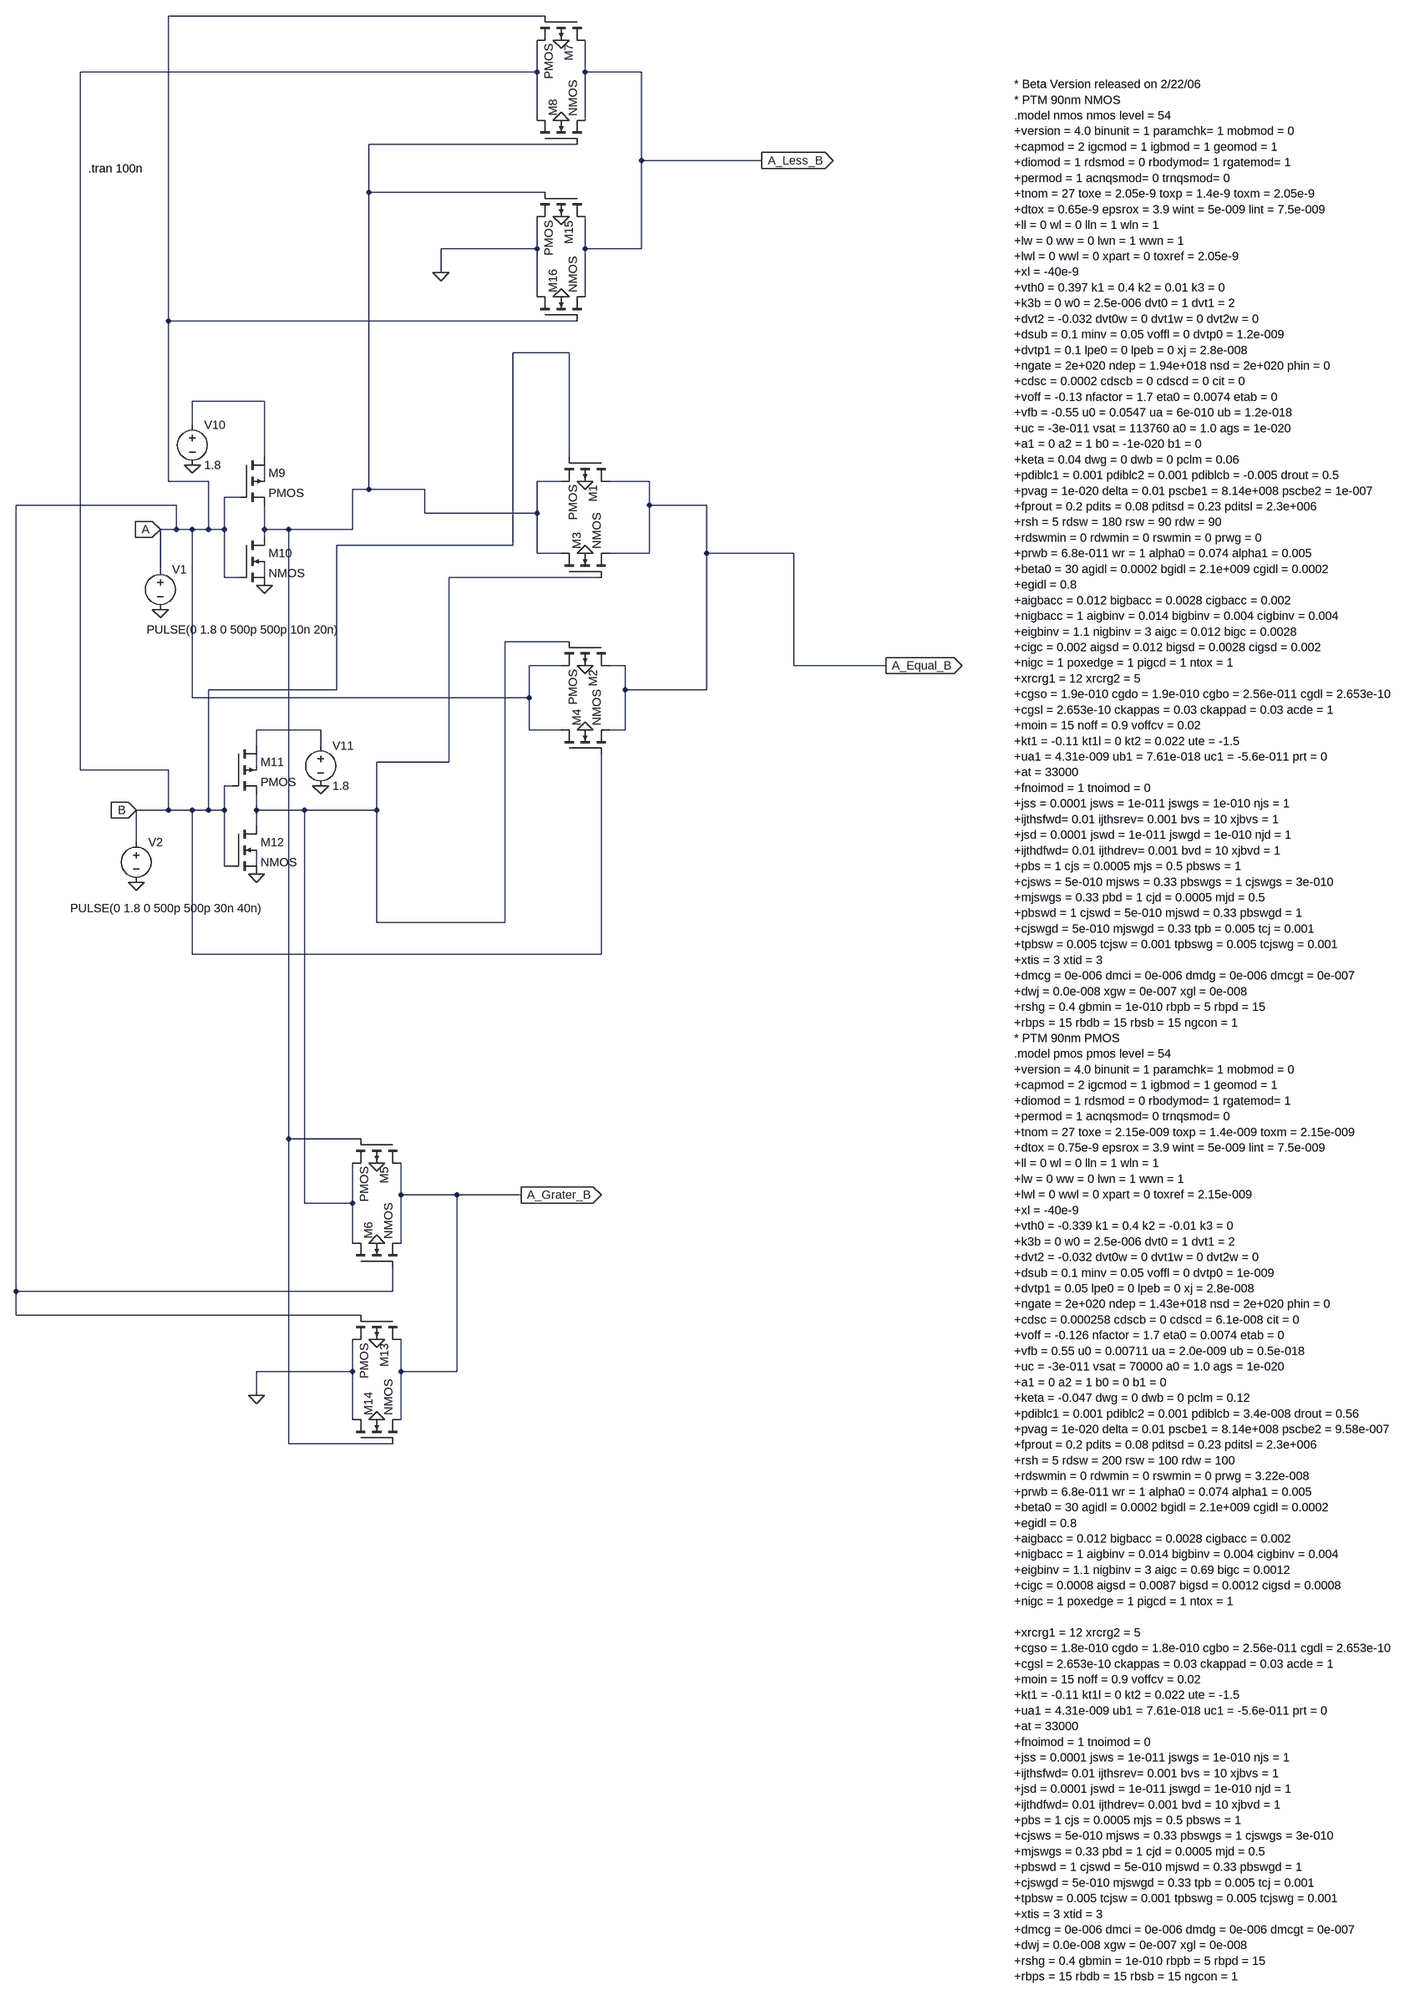
[diagram p0: schematic Comparator-tg-90nm.asc]
Comparator-tg-90nm.asc, the LTspice schematic file:
Version 4
SHEET 1 2340 1880
WIRE 160 -976 -592 -976
WIRE 144 -864 144 -928
WIRE 144 -864 -768 -864
WIRE 240 -864 240 -928
WIRE 352 -864 240 -864
WIRE 144 -768 144 -864
WIRE 240 -768 240 -864
WIRE 224 -720 -192 -720
WIRE 352 -688 352 -864
WIRE 816 -688 352 -688
WIRE -192 -624 -192 -720
WIRE 160 -624 -192 -624
WIRE 144 -512 144 -576
WIRE 144 -512 -48 -512
WIRE 240 -512 240 -576
WIRE 352 -512 352 -688
WIRE 352 -512 240 -512
WIRE -48 -464 -48 -512
WIRE 144 -416 144 -512
WIRE 240 -416 240 -512
WIRE -592 -368 -592 -976
WIRE 224 -368 -592 -368
WIRE 208 -304 96 -304
WIRE -400 -208 -544 -208
WIRE -544 -160 -544 -208
WIRE -400 -96 -400 -208
WIRE 208 -96 208 -304
WIRE -592 -48 -592 -368
WIRE -512 -48 -592 -48
WIRE -400 -48 -400 -80
WIRE 192 -48 144 -48
WIRE 368 -48 288 -48
WIRE -192 -32 -192 -624
WIRE -192 -32 -224 -32
WIRE -80 -32 -192 -32
WIRE -448 -16 -480 -16
WIRE -576 0 -896 0
WIRE 368 0 368 -48
WIRE 496 0 368 0
WIRE -80 16 -80 -32
WIRE 144 16 144 -48
WIRE 144 16 -80 16
WIRE -576 48 -576 0
WIRE -576 48 -608 48
WIRE -544 48 -576 48
WIRE -512 48 -512 -48
WIRE -512 48 -544 48
WIRE -480 48 -480 -16
WIRE -480 48 -512 48
WIRE -400 48 -400 0
WIRE -352 48 -400 48
WIRE -224 48 -224 -32
WIRE -224 48 -352 48
WIRE -400 64 -400 48
WIRE 96 80 96 -304
WIRE 96 80 -256 80
WIRE 144 96 144 16
WIRE 192 96 144 96
WIRE 368 96 368 0
WIRE 368 96 288 96
WIRE 496 96 496 0
WIRE 880 96 496 96
WIRE -608 128 -608 48
WIRE -480 144 -480 48
WIRE -448 144 -480 144
WIRE -400 144 -400 112
WIRE 272 144 -32 144
WIRE 208 272 80 272
WIRE 192 320 128 320
WIRE 320 320 288 320
WIRE 880 320 880 96
WIRE 1312 320 880 320
WIRE -256 368 -256 80
WIRE -256 368 -512 368
WIRE 320 368 320 320
WIRE 496 368 496 96
WIRE 496 368 320 368
WIRE -544 384 -544 48
WIRE 128 384 128 320
WIRE 128 384 -544 384
WIRE -288 448 -416 448
WIRE 128 448 128 384
WIRE 192 448 128 448
WIRE 320 448 320 368
WIRE 320 448 288 448
WIRE -416 480 -416 448
WIRE -288 480 -288 448
WIRE -32 512 -32 144
WIRE -32 512 -176 512
WIRE -768 528 -768 -864
WIRE -592 528 -768 528
WIRE -416 528 -416 496
WIRE -464 560 -480 560
WIRE -592 608 -592 528
WIRE -592 608 -656 608
WIRE -544 608 -592 608
WIRE -512 608 -512 368
WIRE -512 608 -544 608
WIRE -480 608 -480 560
WIRE -480 608 -512 608
WIRE -416 608 -416 576
WIRE -320 608 -416 608
WIRE -176 608 -176 512
WIRE -176 608 -320 608
WIRE -416 640 -416 608
WIRE -656 672 -656 608
WIRE -480 720 -480 608
WIRE -464 720 -480 720
WIRE -416 720 -416 688
WIRE -176 832 -176 608
WIRE 80 832 80 272
WIRE 80 832 -176 832
WIRE -544 896 -544 608
WIRE 272 896 272 496
WIRE 272 896 -544 896
WIRE -352 1264 -352 48
WIRE -208 1264 -352 1264
WIRE -128 1376 -128 1312
WIRE -16 1376 -128 1376
WIRE 112 1376 -16 1376
WIRE -320 1392 -320 608
WIRE -224 1392 -224 1312
WIRE -224 1392 -320 1392
WIRE -224 1472 -224 1392
WIRE -128 1472 -128 1376
WIRE -896 1568 -896 0
WIRE -144 1568 -144 1520
WIRE -144 1568 -896 1568
WIRE -896 1616 -896 1568
WIRE -208 1616 -896 1616
WIRE -224 1728 -224 1664
WIRE -224 1728 -416 1728
WIRE -128 1728 -128 1664
WIRE -16 1728 -16 1376
WIRE -16 1728 -128 1728
WIRE -416 1776 -416 1728
WIRE -224 1824 -224 1728
WIRE -128 1824 -128 1728
WIRE -352 1872 -352 1264
WIRE -144 1872 -352 1872
FLAG -416 736 0
FLAG -400 160 0
FLAG -608 208 0
FLAG -656 752 0
FLAG -608 48 A
IOPIN -608 48 In
FLAG -656 608 B
IOPIN -656 608 In
FLAG 816 -688 A_Less_B
IOPIN 816 -688 Out
FLAG -544 -80 0
FLAG -288 560 0
FLAG 112 1376 A_Grater_B
IOPIN 112 1376 Out
FLAG 1312 320 A_Equal_B
IOPIN 1312 320 Out
FLAG -416 1776 0
FLAG -48 -464 0
FLAG 192 -928 0
FLAG 192 -768 0
FLAG 192 -576 0
FLAG 192 -416 0
FLAG -176 1824 0
FLAG -176 1664 0
FLAG -176 1472 0
FLAG -176 1312 0
FLAG 240 -48 0
FLAG 240 96 0
FLAG 240 320 0
FLAG 240 448 0
SYMBOL pmos4 -448 -96 R0
SYMATTR InstName M9
SYMATTR Value2 l=90nm w=270nm
SYMBOL nmos4 -448 64 R0
SYMATTR InstName M10
SYMATTR Value2 l=90nm w=270nm
SYMBOL pmos4 -464 480 R0
SYMATTR InstName M11
SYMATTR Value2 l=90nm w=270nm
SYMBOL nmos4 -464 640 R0
SYMATTR InstName M12
SYMATTR Value2 l=90nm w=270nm
SYMBOL voltage -608 112 R0
WINDOW 3 -27 136 Left 2
WINDOW 123 0 0 Left 0
WINDOW 39 0 0 Left 0
SYMATTR Value PULSE(0 1.8 0 500p 500p 10n 20n)
SYMATTR InstName V1
SYMBOL voltage -656 656 R0
WINDOW 3 -132 148 Left 2
WINDOW 123 0 0 Left 0
WINDOW 39 0 0 Left 0
SYMATTR Value PULSE(0 1.8 0 500p 500p 30n 40n)
SYMATTR InstName V2
SYMBOL voltage -544 -176 R0
WINDOW 123 0 0 Left 0
WINDOW 39 0 0 Left 0
SYMATTR InstName V10
SYMATTR Value 1.8
SYMBOL voltage -288 464 R0
WINDOW 123 0 0 Left 0
WINDOW 39 0 0 Left 0
SYMATTR InstName V11
SYMATTR Value 1.8
SYMBOL pmos4 288 -96 R90
SYMATTR InstName M1
SYMATTR Value2 l=90nm w=270nm
SYMBOL pmos4 288 272 R90
SYMATTR InstName M2
SYMATTR Value2 l=90nm w=270nm
SYMBOL nmos4 192 144 R270
SYMATTR InstName M3
SYMATTR Value2 l=90nm w=270nm
SYMBOL nmos4 192 496 R270
SYMATTR InstName M4
SYMATTR Value2 l=90nm w=270nm
SYMBOL pmos4 -128 1264 R90
SYMATTR InstName M5
SYMATTR Value2 l=90nm w=270nm
SYMBOL nmos4 -224 1520 R270
SYMATTR InstName M6
SYMATTR Value2 l=90nm w=270nm
SYMBOL pmos4 -128 1616 R90
SYMATTR InstName M13
SYMATTR Value2 l=90nm w=270nm
SYMBOL nmos4 -224 1872 R270
SYMATTR InstName M14
SYMATTR Value2 l=90nm w=270nm
SYMBOL pmos4 240 -976 R90
SYMATTR InstName M7
SYMATTR Value2 l=90nm w=270nm
SYMBOL nmos4 144 -720 R270
SYMATTR InstName M8
SYMATTR Value2 l=90nm w=270nm
SYMBOL pmos4 240 -624 R90
SYMATTR InstName M15
SYMATTR Value2 l=90nm w=270nm
SYMBOL nmos4 144 -368 R270
SYMATTR InstName M16
SYMATTR Value2 l=90nm w=270nm
TEXT -752 -672 Left 2 !.tran 100n
TEXT 1688 -840 Left 2 !* Beta Version released on 2/22/06\n* PTM 90nm NMOS\n.model nmos nmos level = 54\n+version = 4.0 binunit = 1 paramchk= 1 mobmod = 0\n+capmod = 2 igcmod = 1 igbmod = 1 geomod = 1\n+diomod = 1 rdsmod = 0 rbodymod= 1 rgatemod= 1\n+permod = 1 acnqsmod= 0 trnqsmod= 0\n+tnom = 27 toxe = 2.05e-9 toxp = 1.4e-9 toxm = 2.05e-9\n+dtox = 0.65e-9 epsrox = 3.9 wint = 5e-009 lint = 7.5e-009\n+ll = 0 wl = 0 lln = 1 wln = 1\n+lw = 0 ww = 0 lwn = 1 wwn = 1\n+lwl = 0 wwl = 0 xpart = 0 toxref = 2.05e-9\n+xl = -40e-9\n+vth0 = 0.397 k1 = 0.4 k2 = 0.01 k3 = 0\n+k3b = 0 w0 = 2.5e-006 dvt0 = 1 dvt1 = 2\n+dvt2 = -0.032 dvt0w = 0 dvt1w = 0 dvt2w = 0\n+dsub = 0.1 minv = 0.05 voffl = 0 dvtp0 = 1.2e-009\n+dvtp1 = 0.1 lpe0 = 0 lpeb = 0 xj = 2.8e-008\n+ngate = 2e+020 ndep = 1.94e+018 nsd = 2e+020 phin = 0\n+cdsc = 0.0002 cdscb = 0 cdscd = 0 cit = 0\n+voff = -0.13 nfactor = 1.7 eta0 = 0.0074 etab = 0\n+vfb = -0.55 u0 = 0.0547 ua = 6e-010 ub = 1.2e-018\n+uc = -3e-011 vsat = 113760 a0 = 1.0 ags = 1e-020\n+a1 = 0 a2 = 1 b0 = -1e-020 b1 = 0\n+keta = 0.04 dwg = 0 dwb = 0 pclm = 0.06\n+pdiblc1 = 0.001 pdiblc2 = 0.001 pdiblcb = -0.005 drout = 0.5\n+pvag = 1e-020 delta = 0.01 pscbe1 = 8.14e+008 pscbe2 = 1e-007\n+fprout = 0.2 pdits = 0.08 pditsd = 0.23 pditsl = 2.3e+006\n+rsh = 5 rdsw = 180 rsw = 90 rdw = 90\n+rdswmin = 0 rdwmin = 0 rswmin = 0 prwg = 0\n+prwb = 6.8e-011 wr = 1 alpha0 = 0.074 alpha1 = 0.005\n+beta0 = 30 agidl = 0.0002 bgidl = 2.1e+009 cgidl = 0.0002\n+egidl = 0.8\n+aigbacc = 0.012 bigbacc = 0.0028 cigbacc = 0.002\n+nigbacc = 1 aigbinv = 0.014 bigbinv = 0.004 cigbinv = 0.004\n+eigbinv = 1.1 nigbinv = 3 aigc = 0.012 bigc = 0.0028\n+cigc = 0.002 aigsd = 0.012 bigsd = 0.0028 cigsd = 0.002\n+nigc = 1 poxedge = 1 pigcd = 1 ntox = 1\n+xrcrg1 = 12 xrcrg2 = 5\n+cgso = 1.9e-010 cgdo = 1.9e-010 cgbo = 2.56e-011 cgdl = 2.653e-10\n+cgsl = 2.653e-10 ckappas = 0.03 ckappad = 0.03 acde = 1\n+moin = 15 noff = 0.9 voffcv = 0.02\n+kt1 = -0.11 kt1l = 0 kt2 = 0.022 ute = -1.5\n+ua1 = 4.31e-009 ub1 = 7.61e-018 uc1 = -5.6e-011 prt = 0\n+at = 33000\n+fnoimod = 1 tnoimod = 0\n+jss = 0.0001 jsws = 1e-011 jswgs = 1e-010 njs = 1\n+ijthsfwd= 0.01 ijthsrev= 0.001 bvs = 10 xjbvs = 1\n+jsd = 0.0001 jswd = 1e-011 jswgd = 1e-010 njd = 1\n+ijthdfwd= 0.01 ijthdrev= 0.001 bvd = 10 xjbvd = 1\n+pbs = 1 cjs = 0.0005 mjs = 0.5 pbsws = 1\n+cjsws = 5e-010 mjsws = 0.33 pbswgs = 1 cjswgs = 3e-010\n+mjswgs = 0.33 pbd = 1 cjd = 0.0005 mjd = 0.5\n+pbswd = 1 cjswd = 5e-010 mjswd = 0.33 pbswgd = 1\n+cjswgd = 5e-010 mjswgd = 0.33 tpb = 0.005 tcj = 0.001\n+tpbsw = 0.005 tcjsw = 0.001 tpbswg = 0.005 tcjswg = 0.001\n+xtis = 3 xtid = 3\n+dmcg = 0e-006 dmci = 0e-006 dmdg = 0e-006 dmcgt = 0e-007\n+dwj = 0.0e-008 xgw = 0e-007 xgl = 0e-008\n+rshg = 0.4 gbmin = 1e-010 rbpb = 5 rbpd = 15\n+rbps = 15 rbdb = 15 rbsb = 15 ngcon = 1\n* PTM 90nm PMOS\n.model pmos pmos level = 54\n+version = 4.0 binunit = 1 paramchk= 1 mobmod = 0\n+capmod = 2 igcmod = 1 igbmod = 1 geomod = 1\n+diomod = 1 rdsmod = 0 rbodymod= 1 rgatemod= 1\n+permod = 1 acnqsmod= 0 trnqsmod= 0\n+tnom = 27 toxe = 2.15e-009 toxp = 1.4e-009 toxm = 2.15e-009\n+dtox = 0.75e-9 epsrox = 3.9 wint = 5e-009 lint = 7.5e-009\n+ll = 0 wl = 0 lln = 1 wln = 1\n+lw = 0 ww = 0 lwn = 1 wwn = 1\n+lwl = 0 wwl = 0 xpart = 0 toxref = 2.15e-009\n+xl = -40e-9\n+vth0 = -0.339 k1 = 0.4 k2 = -0.01 k3 = 0\n+k3b = 0 w0 = 2.5e-006 dvt0 = 1 dvt1 = 2\n+dvt2 = -0.032 dvt0w = 0 dvt1w = 0 dvt2w = 0\n+dsub = 0.1 minv = 0.05 voffl = 0 dvtp0 = 1e-009\n+dvtp1 = 0.05 lpe0 = 0 lpeb = 0 xj = 2.8e-008\n+ngate = 2e+020 ndep = 1.43e+018 nsd = 2e+020 phin = 0\n+cdsc = 0.000258 cdscb = 0 cdscd = 6.1e-008 cit = 0\n+voff = -0.126 nfactor = 1.7 eta0 = 0.0074 etab = 0\n+vfb = 0.55 u0 = 0.00711 ua = 2.0e-009 ub = 0.5e-018\n+uc = -3e-011 vsat = 70000 a0 = 1.0 ags = 1e-020\n+a1 = 0 a2 = 1 b0 = 0 b1 = 0\n+keta = -0.047 dwg = 0 dwb = 0 pclm = 0.12\n+pdiblc1 = 0.001 pdiblc2 = 0.001 pdiblcb = 3.4e-008 drout = 0.56\n+pvag = 1e-020 delta = 0.01 pscbe1 = 8.14e+008 pscbe2 = 9.58e-007\n+fprout = 0.2 pdits = 0.08 pditsd = 0.23 pditsl = 2.3e+006\n+rsh = 5 rdsw = 200 rsw = 100 rdw = 100\n+rdswmin = 0 rdwmin = 0 rswmin = 0 prwg = 3.22e-008\n+prwb = 6.8e-011 wr = 1 alpha0 = 0.074 alpha1 = 0.005\n+beta0 = 30 agidl = 0.0002 bgidl = 2.1e+009 cgidl = 0.0002\n+egidl = 0.8\n+aigbacc = 0.012 bigbacc = 0.0028 cigbacc = 0.002\n+nigbacc = 1 aigbinv = 0.014 bigbinv = 0.004 cigbinv = 0.004\n+eigbinv = 1.1 nigbinv = 3 aigc = 0.69 bigc = 0.0012\n+cigc = 0.0008 aigsd = 0.0087 bigsd = 0.0012 cigsd = 0.0008\n+nigc = 1 poxedge = 1 pigcd = 1 ntox = 1\n \n+xrcrg1 = 12 xrcrg2 = 5\n+cgso = 1.8e-010 cgdo = 1.8e-010 cgbo = 2.56e-011 cgdl = 2.653e-10\n+cgsl = 2.653e-10 ckappas = 0.03 ckappad = 0.03 acde = 1\n+moin = 15 noff = 0.9 voffcv = 0.02\n+kt1 = -0.11 kt1l = 0 kt2 = 0.022 ute = -1.5\n+ua1 = 4.31e-009 ub1 = 7.61e-018 uc1 = -5.6e-011 prt = 0\n+at = 33000\n+fnoimod = 1 tnoimod = 0\n+jss = 0.0001 jsws = 1e-011 jswgs = 1e-010 njs = 1\n+ijthsfwd= 0.01 ijthsrev= 0.001 bvs = 10 xjbvs = 1\n+jsd = 0.0001 jswd = 1e-011 jswgd = 1e-010 njd = 1\n+ijthdfwd= 0.01 ijthdrev= 0.001 bvd = 10 xjbvd = 1\n+pbs = 1 cjs = 0.0005 mjs = 0.5 pbsws = 1\n+cjsws = 5e-010 mjsws = 0.33 pbswgs = 1 cjswgs = 3e-010\n+mjswgs = 0.33 pbd = 1 cjd = 0.0005 mjd = 0.5\n+pbswd = 1 cjswd = 5e-010 mjswd = 0.33 pbswgd = 1\n+cjswgd = 5e-010 mjswgd = 0.33 tpb = 0.005 tcj = 0.001\n+tpbsw = 0.005 tcjsw = 0.001 tpbswg = 0.005 tcjswg = 0.001\n+xtis = 3 xtid = 3\n+dmcg = 0e-006 dmci = 0e-006 dmdg = 0e-006 dmcgt = 0e-007\n+dwj = 0.0e-008 xgw = 0e-007 xgl = 0e-008\n+rshg = 0.4 gbmin = 1e-010 rbpb = 5 rbpd = 15\n+rbps = 15 rbdb = 15 rbsb = 15 ngcon = 1

The netlist it stands for:
* Comparator-tg-90nm.asc
M9 N002 A N001 N003 PMOS l=90nm w=270nm
M10 N001 A 0 N004 NMOS l=90nm w=270nm
M11 N006 B N005 N007 PMOS l=90nm w=270nm
M12 N005 B 0 N008 NMOS l=90nm w=270nm
V1 A 0 PULSE(0 1.8 0 500p 500p 10n 20n)
V2 B 0 PULSE(0 1.8 0 500p 500p 30n 40n)
V10 N002 0 1.8
V11 N006 0 1.8
M1 A_Equal_B B N001 0 PMOS l=90nm w=270nm
M2 A_Equal_B N005 A 0 PMOS l=90nm w=270nm
M3 N001 N005 A_Equal_B 0 NMOS l=90nm w=270nm
M4 A B A_Equal_B 0 NMOS l=90nm w=270nm
M5 A_Grater_B N001 N005 0 PMOS l=90nm w=270nm
M6 N005 A A_Grater_B 0 NMOS l=90nm w=270nm
M13 A_Grater_B A 0 0 PMOS l=90nm w=270nm
M14 0 N001 A_Grater_B 0 NMOS l=90nm w=270nm
M7 A_Less_B A B 0 PMOS l=90nm w=270nm
M8 B N001 A_Less_B 0 NMOS l=90nm w=270nm
M15 A_Less_B N001 0 0 PMOS l=90nm w=270nm
M16 0 A A_Less_B 0 NMOS l=90nm w=270nm
.model NMOS NMOS
.model PMOS PMOS
.lib standard.mos
.tran 100n
* Beta Version released on 2/22/06
* PTM 90nm NMOS
.model nmos nmos level = 54
+version = 4.0 binunit = 1 paramchk= 1 mobmod = 0
+capmod = 2 igcmod = 1 igbmod = 1 geomod = 1
+diomod = 1 rdsmod = 0 rbodymod= 1 rgatemod= 1
+permod = 1 acnqsmod= 0 trnqsmod= 0
+tnom = 27 toxe = 2.05e-9 toxp = 1.4e-9 toxm = 2.05e-9
+dtox = 0.65e-9 epsrox = 3.9 wint = 5e-009 lint = 7.5e-009
+ll = 0 wl = 0 lln = 1 wln = 1
+lw = 0 ww = 0 lwn = 1 wwn = 1
+lwl = 0 wwl = 0 xpart = 0 toxref = 2.05e-9
+xl = -40e-9
+vth0 = 0.397 k1 = 0.4 k2 = 0.01 k3 = 0
+k3b = 0 w0 = 2.5e-006 dvt0 = 1 dvt1 = 2
+dvt2 = -0.032 dvt0w = 0 dvt1w = 0 dvt2w = 0
+dsub = 0.1 minv = 0.05 voffl = 0 dvtp0 = 1.2e-009
+dvtp1 = 0.1 lpe0 = 0 lpeb = 0 xj = 2.8e-008
+ngate = 2e+020 ndep = 1.94e+018 nsd = 2e+020 phin = 0
+cdsc = 0.0002 cdscb = 0 cdscd = 0 cit = 0
+voff = -0.13 nfactor = 1.7 eta0 = 0.0074 etab = 0
+vfb = -0.55 u0 = 0.0547 ua = 6e-010 ub = 1.2e-018
+uc = -3e-011 vsat = 113760 a0 = 1.0 ags = 1e-020
+a1 = 0 a2 = 1 b0 = -1e-020 b1 = 0
+keta = 0.04 dwg = 0 dwb = 0 pclm = 0.06
+pdiblc1 = 0.001 pdiblc2 = 0.001 pdiblcb = -0.005 drout = 0.5
+pvag = 1e-020 delta = 0.01 pscbe1 = 8.14e+008 pscbe2 = 1e-007
+fprout = 0.2 pdits = 0.08 pditsd = 0.23 pditsl = 2.3e+006
+rsh = 5 rdsw = 180 rsw = 90 rdw = 90
+rdswmin = 0 rdwmin = 0 rswmin = 0 prwg = 0
+prwb = 6.8e-011 wr = 1 alpha0 = 0.074 alpha1 = 0.005
+beta0 = 30 agidl = 0.0002 bgidl = 2.1e+009 cgidl = 0.0002
+egidl = 0.8
+aigbacc = 0.012 bigbacc = 0.0028 cigbacc = 0.002
+nigbacc = 1 aigbinv = 0.014 bigbinv = 0.004 cigbinv = 0.004
+eigbinv = 1.1 nigbinv = 3 aigc = 0.012 bigc = 0.0028
+cigc = 0.002 aigsd = 0.012 bigsd = 0.0028 cigsd = 0.002
+nigc = 1 poxedge = 1 pigcd = 1 ntox = 1
+xrcrg1 = 12 xrcrg2 = 5
+cgso = 1.9e-010 cgdo = 1.9e-010 cgbo = 2.56e-011 cgdl = 2.653e-10
+cgsl = 2.653e-10 ckappas = 0.03 ckappad = 0.03 acde = 1
+moin = 15 noff = 0.9 voffcv = 0.02
+kt1 = -0.11 kt1l = 0 kt2 = 0.022 ute = -1.5
+ua1 = 4.31e-009 ub1 = 7.61e-018 uc1 = -5.6e-011 prt = 0
+at = 33000
+fnoimod = 1 tnoimod = 0
+jss = 0.0001 jsws = 1e-011 jswgs = 1e-010 njs = 1
+ijthsfwd= 0.01 ijthsrev= 0.001 bvs = 10 xjbvs = 1
+jsd = 0.0001 jswd = 1e-011 jswgd = 1e-010 njd = 1
+ijthdfwd= 0.01 ijthdrev= 0.001 bvd = 10 xjbvd = 1
+pbs = 1 cjs = 0.0005 mjs = 0.5 pbsws = 1
+cjsws = 5e-010 mjsws = 0.33 pbswgs = 1 cjswgs = 3e-010
+mjswgs = 0.33 pbd = 1 cjd = 0.0005 mjd = 0.5
+pbswd = 1 cjswd = 5e-010 mjswd = 0.33 pbswgd = 1
+cjswgd = 5e-010 mjswgd = 0.33 tpb = 0.005 tcj = 0.001
+tpbsw = 0.005 tcjsw = 0.001 tpbswg = 0.005 tcjswg = 0.001
+xtis = 3 xtid = 3
+dmcg = 0e-006 dmci = 0e-006 dmdg = 0e-006 dmcgt = 0e-007
+dwj = 0.0e-008 xgw = 0e-007 xgl = 0e-008
+rshg = 0.4 gbmin = 1e-010 rbpb = 5 rbpd = 15
+rbps = 15 rbdb = 15 rbsb = 15 ngcon = 1
* PTM 90nm PMOS
.model pmos pmos level = 54
+version = 4.0 binunit = 1 paramchk= 1 mobmod = 0
+capmod = 2 igcmod = 1 igbmod = 1 geomod = 1
+diomod = 1 rdsmod = 0 rbodymod= 1 rgatemod= 1
+permod = 1 acnqsmod= 0 trnqsmod= 0
+tnom = 27 toxe = 2.15e-009 toxp = 1.4e-009 toxm = 2.15e-009
+dtox = 0.75e-9 epsrox = 3.9 wint = 5e-009 lint = 7.5e-009
+ll = 0 wl = 0 lln = 1 wln = 1
+lw = 0 ww = 0 lwn = 1 wwn = 1
+lwl = 0 wwl = 0 xpart = 0 toxref = 2.15e-009
+xl = -40e-9
+vth0 = -0.339 k1 = 0.4 k2 = -0.01 k3 = 0
+k3b = 0 w0 = 2.5e-006 dvt0 = 1 dvt1 = 2
+dvt2 = -0.032 dvt0w = 0 dvt1w = 0 dvt2w = 0
+dsub = 0.1 minv = 0.05 voffl = 0 dvtp0 = 1e-009
+dvtp1 = 0.05 lpe0 = 0 lpeb = 0 xj = 2.8e-008
+ngate = 2e+020 ndep = 1.43e+018 nsd = 2e+020 phin = 0
+cdsc = 0.000258 cdscb = 0 cdscd = 6.1e-008 cit = 0
+voff = -0.126 nfactor = 1.7 eta0 = 0.0074 etab = 0
+vfb = 0.55 u0 = 0.00711 ua = 2.0e-009 ub = 0.5e-018
+uc = -3e-011 vsat = 70000 a0 = 1.0 ags = 1e-020
+a1 = 0 a2 = 1 b0 = 0 b1 = 0
+keta = -0.047 dwg = 0 dwb = 0 pclm = 0.12
+pdiblc1 = 0.001 pdiblc2 = 0.001 pdiblcb = 3.4e-008 drout = 0.56
+pvag = 1e-020 delta = 0.01 pscbe1 = 8.14e+008 pscbe2 = 9.58e-007
+fprout = 0.2 pdits = 0.08 pditsd = 0.23 pditsl = 2.3e+006
+rsh = 5 rdsw = 200 rsw = 100 rdw = 100
+rdswmin = 0 rdwmin = 0 rswmin = 0 prwg = 3.22e-008
+prwb = 6.8e-011 wr = 1 alpha0 = 0.074 alpha1 = 0.005
+beta0 = 30 agidl = 0.0002 bgidl = 2.1e+009 cgidl = 0.0002
+egidl = 0.8
+aigbacc = 0.012 bigbacc = 0.0028 cigbacc = 0.002
+nigbacc = 1 aigbinv = 0.014 bigbinv = 0.004 cigbinv = 0.004
+eigbinv = 1.1 nigbinv = 3 aigc = 0.69 bigc = 0.0012
+cigc = 0.0008 aigsd = 0.0087 bigsd = 0.0012 cigsd = 0.0008
+nigc = 1 poxedge = 1 pigcd = 1 ntox = 1
+xrcrg1 = 12 xrcrg2 = 5
+cgso = 1.8e-010 cgdo = 1.8e-010 cgbo = 2.56e-011 cgdl = 2.653e-10
+cgsl = 2.653e-10 ckappas = 0.03 ckappad = 0.03 acde = 1
+moin = 15 noff = 0.9 voffcv = 0.02
+kt1 = -0.11 kt1l = 0 kt2 = 0.022 ute = -1.5
+ua1 = 4.31e-009 ub1 = 7.61e-018 uc1 = -5.6e-011 prt = 0
+at = 33000
+fnoimod = 1 tnoimod = 0
+jss = 0.0001 jsws = 1e-011 jswgs = 1e-010 njs = 1
+ijthsfwd= 0.01 ijthsrev= 0.001 bvs = 10 xjbvs = 1
+jsd = 0.0001 jswd = 1e-011 jswgd = 1e-010 njd = 1
+ijthdfwd= 0.01 ijthdrev= 0.001 bvd = 10 xjbvd = 1
+pbs = 1 cjs = 0.0005 mjs = 0.5 pbsws = 1
+cjsws = 5e-010 mjsws = 0.33 pbswgs = 1 cjswgs = 3e-010
+mjswgs = 0.33 pbd = 1 cjd = 0.0005 mjd = 0.5
+pbswd = 1 cjswd = 5e-010 mjswd = 0.33 pbswgd = 1
+cjswgd = 5e-010 mjswgd = 0.33 tpb = 0.005 tcj = 0.001
+tpbsw = 0.005 tcjsw = 0.001 tpbswg = 0.005 tcjswg = 0.001
+xtis = 3 xtid = 3
+dmcg = 0e-006 dmci = 0e-006 dmdg = 0e-006 dmcgt = 0e-007
+dwj = 0.0e-008 xgw = 0e-007 xgl = 0e-008
+rshg = 0.4 gbmin = 1e-010 rbpb = 5 rbpd = 15
+rbps = 15 rbdb = 15 rbsb = 15 ngcon = 1
.backanno
.end